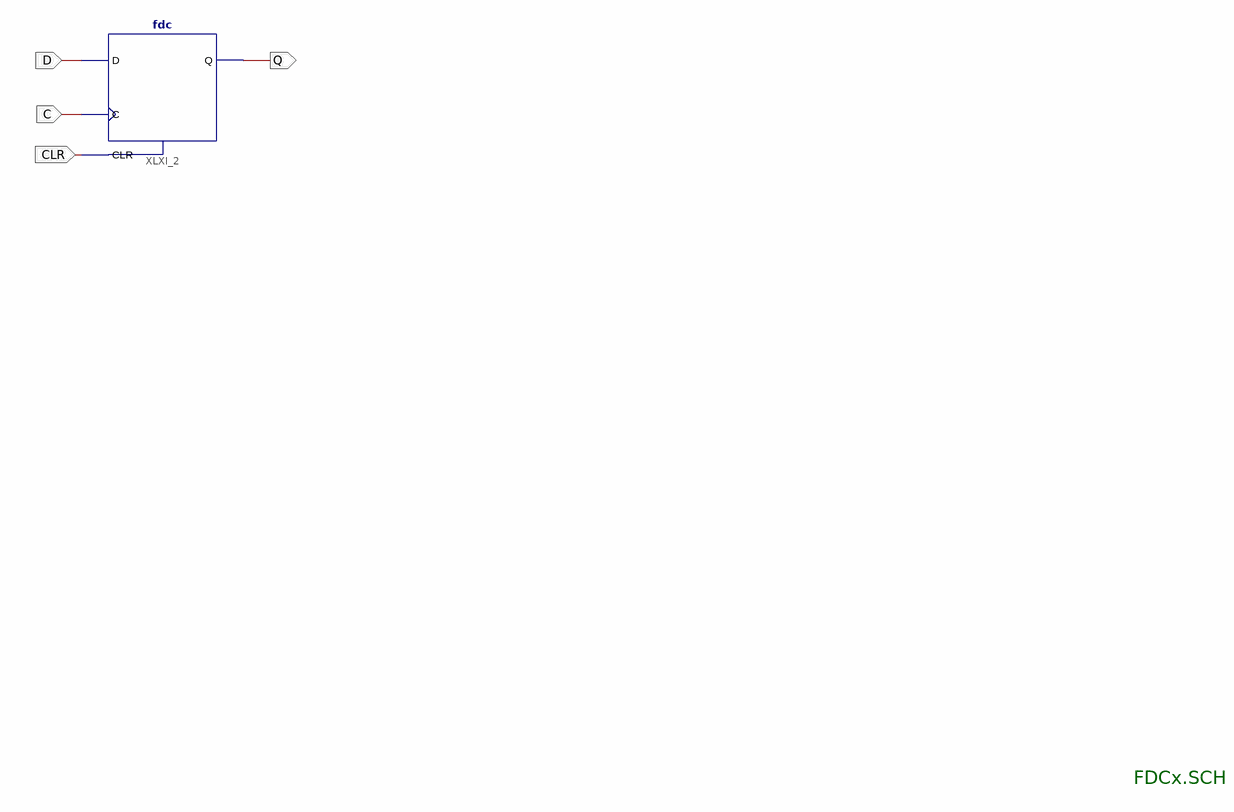
[diagram p0: schematic sheet 1]
// Xilinx ISE schematic FDCx.sch (spartan3e) as structural Verilog: 1 symbols, 4 ports
module FDCx (
  input  D,
  input  C,
  input  CLR,
  output Q
);

  fdc XLXI_2 (.C(C), .CLR(CLR), .D(D), .Q(Q));

  // Notes on the sheet:
  //   FDCx.SCH
endmodule
